# Altium schematic sheet ArduHoop.SchDoc
size B
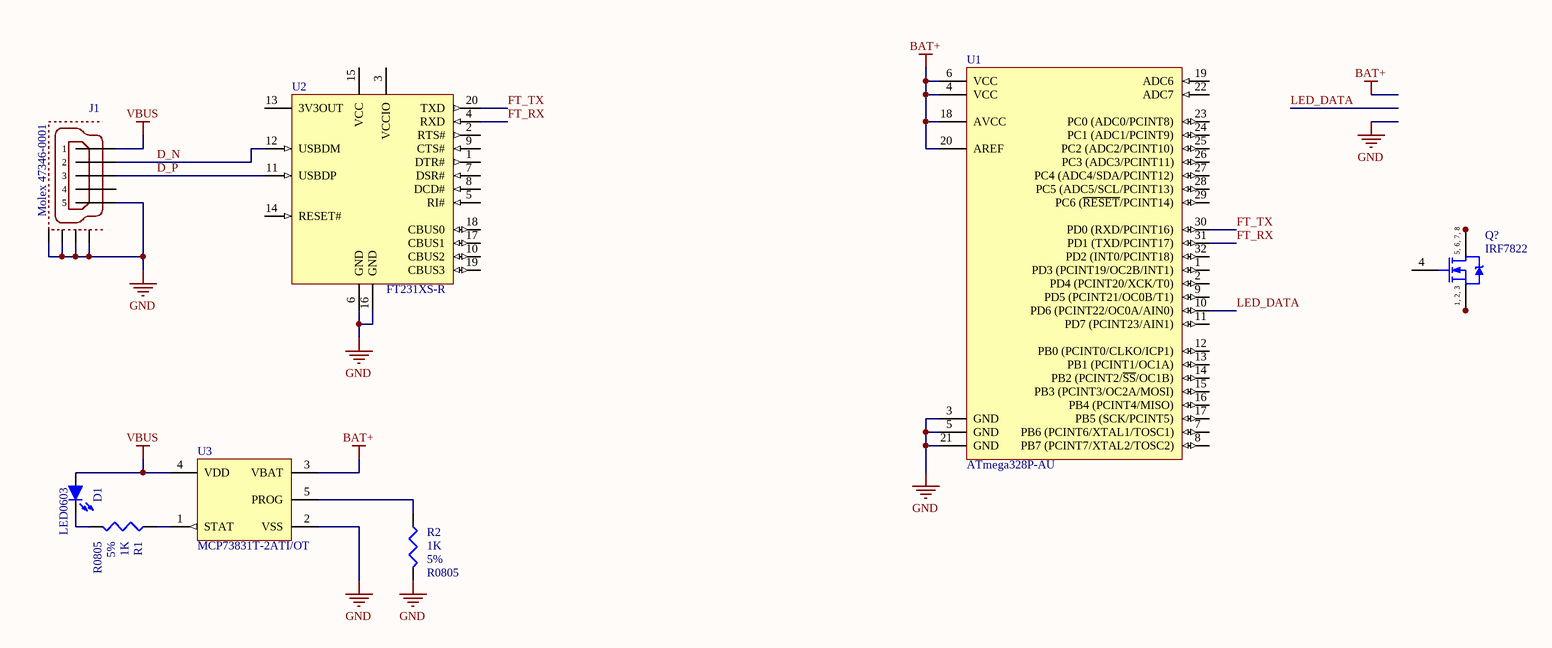
[diagram p0: ArduHoop.SchDoc]

## Parts
D1  LED0603  [LED0603]
J1  Molex 47346-0001  [Molex 47346-0001]
Q?  IRF7822  [SO-8_M]
R1  value 1K  Tolerance: 5%  [R0805]  (hidden comment: Resistor)
R2  value 1K  Tolerance: 5%  [R0805]  (hidden comment: Resistor)
U1  ATmega328P-AU  [32A_N]
U2  FT231XS-R  [SSOP-20_N]
U3  MCP73831T-2ATI/OT  [SOT-23-OT5_N]

## Nets
BAT+: U1.4(VCC) U1.6(VCC) U1.18(AVCC) U1.20(AREF) U3.3(VBAT)
GND: J1.GND(5) J1.GND1 J1.GND2 J1.GND3 J1.GND4 R2.2 U1.3(GND) U1.5(GND) U1.21(GND) U2.6(GND) U2.16(GND) U3.2(VSS)
VBUS: D1.A J1.VBUS(1) U3.4(VDD)
D_N: J1.D-(2) U2.12(USBDM)
D_P: J1.D+(3) U2.11(USBDP)
FT_RX: U1.31(PD1_(TXD/PCINT17)) U2.4(RXD)
FT_TX: U1.30(PD0_(RXD/PCINT16)) U2.20(TXD)
LED_DATA: U1.10(PD6_(PCINT22/OC0A/AIN0))
NetD1_C: D1.C R1.2
NetQ?_1: Q?.1(S) Q?.2(S) Q?.3(S)
NetQ?_5: Q?.5(D) Q?.6(D) Q?.7(D) Q?.8(D)
NetR1_1: R1.1 U3.1(STAT)
NetR2_1: R2.1 U3.5(PROG)

Not connected (* = marked no-connect by the designer): J1 ID(4); Q? 4(G); U1 1(PD3_(PCINT19/OC2B/INT1)) 2(PD4_(PCINT20/XCK/T0)) 7(PB6_(PCINT6/XTAL1/TOSC1)) 8(PB7_(PCINT7/XTAL2/TOSC2)) 9(PD5_(PCINT21/OC0B/T1)) 11(PD7_(PCINT23/AIN1)) 12(PB0_(PCINT0/CLKO/ICP1)) 13(PB1_(PCINT1/OC1A)) 14(PB2_(PCINT2/~{SS}/OC1B)) 15(PB3_(PCINT3/OC2A/MOSI)) 16(PB4_(PCINT4/MISO)) 17(PB5_(SCK/PCINT5)) 19(ADC6) 22(ADC7) 23(PC0_(ADC0/PCINT8)) 24(PC1_(ADC1/PCINT9)) 25(PC2_(ADC2/PCINT10)) 26(PC3_(ADC3/PCINT11)) 27(PC4_(ADC4/SDA/PCINT12)) 28(PC5_(ADC5/SCL/PCINT13)) 29(PC6_(~{RESET}/PCINT14)) 32(PD2_(INT0/PCINT18)); U2 1(DTR#) 2(RTS#) 3(VCCIO) 5(RI#) 7(DSR#) 8(DCD#) 9(CTS#) 10(CBUS2) 13(3V3OUT) 14(RESET#) 15(VCC) 17(CBUS1) 18(CBUS0) 19(CBUS3)

## Notes on the sheet
- (in symbol IRF7822) 5, 6, 7, 8; 1, 2, 3

## Library data of the parts
D1 = LED
J1 = USB: Supplier 1: Digi-Key; Supplier Part Number 1: WM17141CT-ND
Q? = IRF7822: HEXFET Power MOSFET; Published: 17-Sep-2003; LatestRevisionDate: 13-Apr-2006; LatestRevisionNote: IPC-7351 Footprint Added.; DatasheetVersion: 11-Jul-2001; PackageVersion: Feb-2001; PackageReference: SO-8; Publisher: Altium Limited; PackageDescription: 8-Pin Plastic Small Outline Integrated Circuit 1.27 mm Pitch; Code_JEDEC: MS-012-AA; Code_IPC: SOIC127P600-8; ComponentLink1Description: Manufacturer Link; ComponentLink1URL: http://www.irf.com/; ComponentLink2Description: Datasheet; ComponentLink2URL: http://www.irf.com/product-info/datasheets/data/irf7822.pdf
U1 = ATmega328P-AU: 8-bit AVR Microcontroller, 32KB Flash, 1KB EEPROM, 2KB SRAM, 32-pin TQFP, Industrial Grade (-40°C to 85°C); DatasheetVersion: revD, May-2011; PackageVersion: revC, Oct-2010; PackageReference: 32A; PackageDescription: 32-Lead, 7x7x1.0 mm Body, 0.8mm Lead Pitch, Thin Profile Plastic Quad Flat Package (TQFP); Code_JEDEC: MS-026-ABA; ComponentLink1Description: Manufacturer URL; ComponentLink1URL: http://www.atmel.com/; ComponentLink2Description: ATmega48A/48PA/88A/88PA/168A/168PA/328/328P Datasheet; ComponentLink2URL: http://www.atmel.com/dyn/resources/prod_documents/doc8271.pdf; ComponentLink3Description: ATmega48A/48PA/88A/88PA/168A/168PA/328/328P Summary; ComponentLink3URL: http://www.atmel.com/dyn/resources/prod_documents/8271S.pdf
U2 = FT231XS-R: USB to Full-Handshake UART Interface Chip, UHCI/OHCI/EHCI Compatible, USB 2.0 Compatible, -40 to +85 degC, 20-Pin SSOP, Pb-Free, Tape and Reel; Manufacturer: FTDI; DatasheetVersion: ver 1.2, Feb-2013; PackageVersion: Feb-13; PackageReference: SSOP-20; PackageDescription: 20-Pin Small Outline Package, 8.6 x 3.9 mm Body, 0.635 mm Pitch; Code_JEDEC: MO-137-AD; PartNumber: FT231XS-R; ComponentLink1Description: Manufacturer URL; ComponentLink1URL: http://www.ftdichip.com/; ComponentLink2Description: Datasheet; ComponentLink2URL: http://www.ftdichip.com/Support/Documents/DataSheets/ICs/DS_FT231X.pdf; ComponentLink3Description: FT231X Product Page; ComponentLink3URL: www.ftdichip.com/Products/ICs/FT231X.html
U3 = MCP73831T-2ATI/OT: Miniature Single-Cell, Fully Integrated Li-Ion, Li-Polymer Charge Management Controller, 4.2V, 5-Pin SOT-23, Industrial Temperature, Tape and Reel; Manufacturer: Microchip; DatasheetVersion: revE, Sep-2008; PackageVersion: revBB, Aug-2009; PackageReference: SOT-23-OT5; PackageDescription: 5-Lead Plastic Small Outline Transistor (OT) [SOT-23]; Supplier 1: Digi-Key; Supplier Part Number 1: MCP73831T-2ATI/OTTR-ND; Supplier 2: Digi-Key; Supplier Part Number 2: MCP73831T-2ATI/OTCT-ND; Supplier 3: Digi-Key; Supplier Part Number 3: MCP73831T-2ATI/OTDKR-ND; Supplier 4: Farnell; Supplier Part Number 4: 1834890RL; Supplier 5: Farnell; Supplier Part Number 5: 1834890; Supplier 6: Newark; Supplier Part Number 6: 84R5196; Supplier 7: Mouser; Supplier Part Number 7: 579-MCP73831T-2ATIOT; Mounting Technology: Surface Mount; Code_IPC: SOT23-5; PartNumber: MCP73831T-2ATI/OT; ComponentLink1Description: Manufacturer URL; ComponentLink1URL: http://www.microchip.com/; ComponentLink2Description: Datasheet; ComponentLink2URL: http://ww1.microchip.com/downloads/en/DeviceDoc/21984e.pdf; ComponentLink3Description: Package Specification; ComponentLink3URL: http://www.microchip.com/stellent/groups/techpub_sg/documents/packagingspec/en012702.pdf